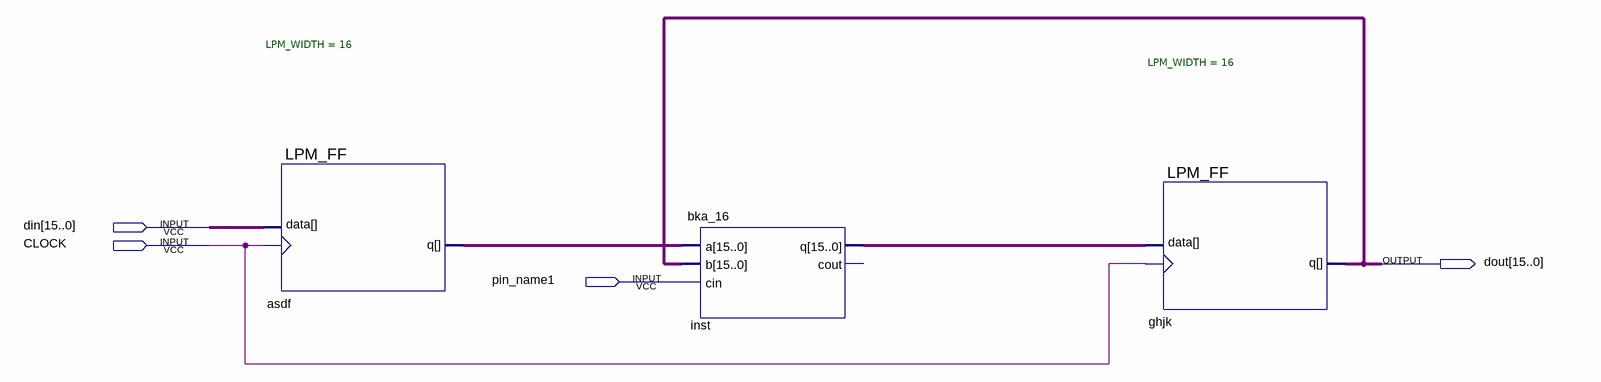
[diagram p0: schematic sheet]
// Quartus schematic adder_eval.bdf as structural Verilog: 3 symbols, 4 pins
module adder_eval (
  input  [15:0] din,
  input  CLOCK,
  input  pin_name1,
  output [15:0] dout
);

  wire [15:0] asdf_q, inst_q;

  LPM_FF #(.LPM_WIDTH(16)) asdf (.clock(CLOCK), .data(din), .q(asdf_q));
  bka_16 inst (.a(asdf_q), .b(dout), .cin(pin_name1), .q(inst_q));  // open: cout
  LPM_FF #(.LPM_WIDTH(16)) ghjk (.clock(CLOCK), .data(inst_q), .q(dout));
endmodule
